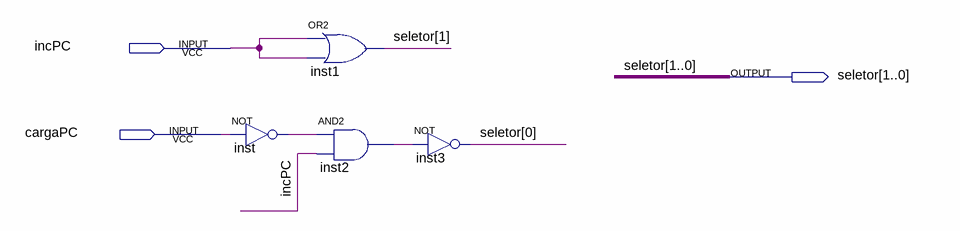
[diagram p0: schematic sheet]
// Quartus schematic DECOD_PC.bdf as structural Verilog: 4 symbols, 3 pins
module DECOD_PC (
  input  incPC,
  input  cargaPC,
  output [1:0] seletor
);

  wire inst2_out, inst_out;

  not inst (inst_out, cargaPC);
  or inst1 (seletor[1], incPC, incPC);
  and inst2 (inst2_out, inst_out, incPC);
  not inst3 (seletor[0], inst2_out);
endmodule
